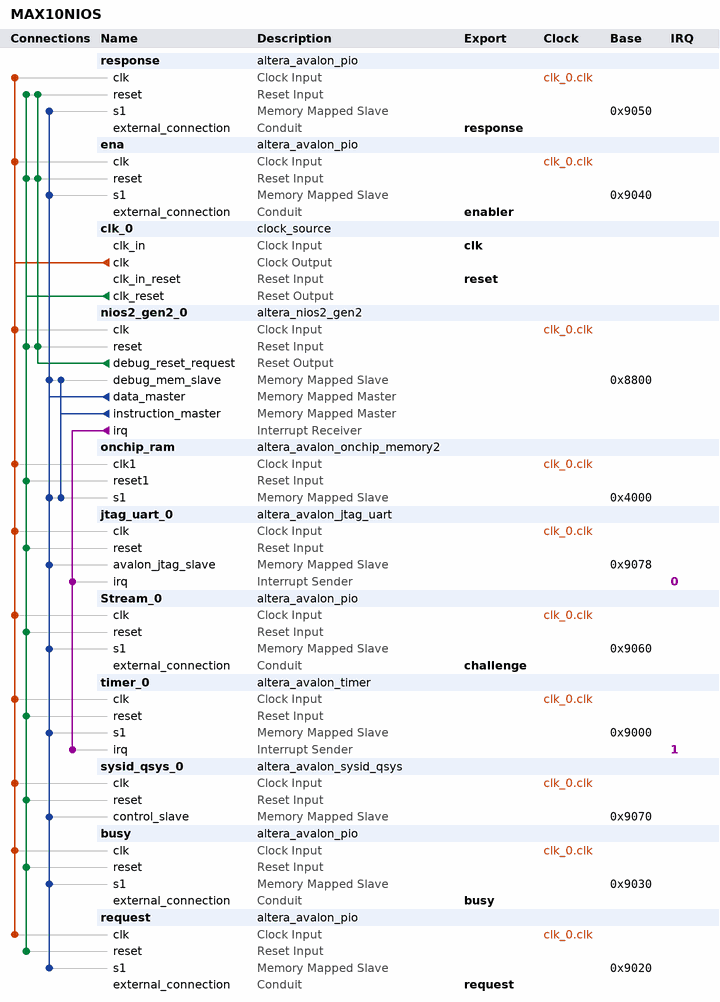
[diagram p0: system contents]
# Platform Designer (Qsys) system MAX10NIOS, MAX 10 10M04SCE144C8G
# Parameters at their usual value, and those the tool derives, are not listed.
package require -exact qsys 22.1
create_system MAX10NIOS
set_project_property DEVICE_FAMILY {MAX 10}
set_project_property DEVICE 10M04SCE144C8G

add_instance response altera_avalon_pio 22.1
set_instance_parameter_value response direction Input
set_instance_parameter_value response width 8

add_instance ena altera_avalon_pio 22.1
set_instance_parameter_value ena direction Output
set_instance_parameter_value ena width 1

add_instance clk_0 clock_source 22.1
set_instance_parameter_value clk_0 clockFrequency 50000000

add_instance nios2_gen2_0 altera_nios2_gen2 22.1
set_instance_parameter_value nios2_gen2_0 dcache_size 2048
set_instance_parameter_value nios2_gen2_0 exceptionSlave onchip_ram.s1
set_instance_parameter_value nios2_gen2_0 icache_size 4096
set_instance_parameter_value nios2_gen2_0 impl Tiny
set_instance_parameter_value nios2_gen2_0 resetSlave onchip_ram.s1

add_instance onchip_ram altera_avalon_onchip_memory2 22.1
set_instance_parameter_value onchip_ram dataWidth 32
set_instance_parameter_value onchip_ram dualPort false
set_instance_parameter_value onchip_ram initMemContent false
set_instance_parameter_value onchip_ram initializationFileName onchip_mem.hex
set_instance_parameter_value onchip_ram memorySize 16384

add_instance jtag_uart_0 altera_avalon_jtag_uart 22.1
set_instance_parameter_value jtag_uart_0 simInteractiveOptions NO_INTERACTIVE_WINDOWS

add_instance Stream_0 altera_avalon_pio 22.1
set_instance_parameter_value Stream_0 direction Output
set_instance_parameter_value Stream_0 width 8

add_instance timer_0 altera_avalon_timer 22.1
set_instance_parameter_value timer_0 period 1
set_instance_parameter_value timer_0 periodUnits MSEC

add_instance sysid_qsys_0 altera_avalon_sysid_qsys 22.1
set_instance_parameter_value sysid_qsys_0 id 0

add_instance busy altera_avalon_pio 22.1
set_instance_parameter_value busy direction Input
set_instance_parameter_value busy width 1

add_instance request altera_avalon_pio 22.1
set_instance_parameter_value request direction Output
set_instance_parameter_value request width 1

# connections
add_connection clk_0.clk busy.clk clock
add_connection clk_0.clk ena.clk clock
add_connection clk_0.clk jtag_uart_0.clk clock
add_connection clk_0.clk nios2_gen2_0.clk clock
add_connection clk_0.clk onchip_ram.clk1 clock
add_connection clk_0.clk request.clk clock
add_connection clk_0.clk response.clk clock
add_connection clk_0.clk Stream_0.clk clock
add_connection clk_0.clk sysid_qsys_0.clk clock
add_connection clk_0.clk timer_0.clk clock
add_connection clk_0.clk_reset busy.reset reset
add_connection clk_0.clk_reset ena.reset reset
add_connection clk_0.clk_reset jtag_uart_0.reset reset
add_connection clk_0.clk_reset nios2_gen2_0.reset reset
add_connection clk_0.clk_reset onchip_ram.reset1 reset
add_connection clk_0.clk_reset request.reset reset
add_connection clk_0.clk_reset response.reset reset
add_connection clk_0.clk_reset Stream_0.reset reset
add_connection clk_0.clk_reset sysid_qsys_0.reset reset
add_connection clk_0.clk_reset timer_0.reset reset
add_connection nios2_gen2_0.debug_reset_request ena.reset reset
add_connection nios2_gen2_0.debug_reset_request nios2_gen2_0.reset reset
add_connection nios2_gen2_0.debug_reset_request response.reset reset
add_connection nios2_gen2_0.data_master busy.s1 avalon
set_connection_parameter_value nios2_gen2_0.data_master/busy.s1 baseAddress 0x9030
add_connection nios2_gen2_0.data_master ena.s1 avalon
set_connection_parameter_value nios2_gen2_0.data_master/ena.s1 baseAddress 0x9040
add_connection nios2_gen2_0.data_master jtag_uart_0.avalon_jtag_slave avalon
set_connection_parameter_value nios2_gen2_0.data_master/jtag_uart_0.avalon_jtag_slave baseAddress 0x9078
add_connection nios2_gen2_0.data_master nios2_gen2_0.debug_mem_slave avalon
set_connection_parameter_value nios2_gen2_0.data_master/nios2_gen2_0.debug_mem_slave baseAddress 0x8800
add_connection nios2_gen2_0.data_master onchip_ram.s1 avalon
set_connection_parameter_value nios2_gen2_0.data_master/onchip_ram.s1 baseAddress 0x4000
add_connection nios2_gen2_0.data_master request.s1 avalon
set_connection_parameter_value nios2_gen2_0.data_master/request.s1 baseAddress 0x9020
add_connection nios2_gen2_0.data_master response.s1 avalon
set_connection_parameter_value nios2_gen2_0.data_master/response.s1 baseAddress 0x9050
add_connection nios2_gen2_0.data_master Stream_0.s1 avalon
set_connection_parameter_value nios2_gen2_0.data_master/Stream_0.s1 baseAddress 0x9060
add_connection nios2_gen2_0.data_master sysid_qsys_0.control_slave avalon
set_connection_parameter_value nios2_gen2_0.data_master/sysid_qsys_0.control_slave baseAddress 0x9070
add_connection nios2_gen2_0.data_master timer_0.s1 avalon
set_connection_parameter_value nios2_gen2_0.data_master/timer_0.s1 baseAddress 0x9000
add_connection nios2_gen2_0.instruction_master nios2_gen2_0.debug_mem_slave avalon
set_connection_parameter_value nios2_gen2_0.instruction_master/nios2_gen2_0.debug_mem_slave baseAddress 0x8800
add_connection nios2_gen2_0.instruction_master onchip_ram.s1 avalon
set_connection_parameter_value nios2_gen2_0.instruction_master/onchip_ram.s1 baseAddress 0x4000
add_connection nios2_gen2_0.irq jtag_uart_0.irq interrupt
set_connection_parameter_value nios2_gen2_0.irq/jtag_uart_0.irq irqNumber 0
add_connection nios2_gen2_0.irq timer_0.irq interrupt
set_connection_parameter_value nios2_gen2_0.irq/timer_0.irq irqNumber 1

# exported interfaces
add_interface busy conduit end
set_interface_property busy EXPORT_OF busy.external_connection
add_interface challenge conduit end
set_interface_property challenge EXPORT_OF Stream_0.external_connection
add_interface clk clock sink
set_interface_property clk EXPORT_OF clk_0.clk_in
add_interface enabler conduit end
set_interface_property enabler EXPORT_OF ena.external_connection
add_interface request conduit end
set_interface_property request EXPORT_OF request.external_connection
add_interface reset reset sink
set_interface_property reset EXPORT_OF clk_0.clk_in_reset
add_interface response conduit end
set_interface_property response EXPORT_OF response.external_connection

set_interconnect_requirement {$system} qsys_mm.clockCrossingAdapter HANDSHAKE
set_interconnect_requirement {$system} qsys_mm.enableEccProtection FALSE
set_interconnect_requirement {$system} qsys_mm.insertDefaultSlave FALSE
set_interconnect_requirement {$system} qsys_mm.maxAdditionalLatency 1

save_system MAX10NIOS.qsys
